# Altium schematic sheet LDO_5V.SchDoc
size A4
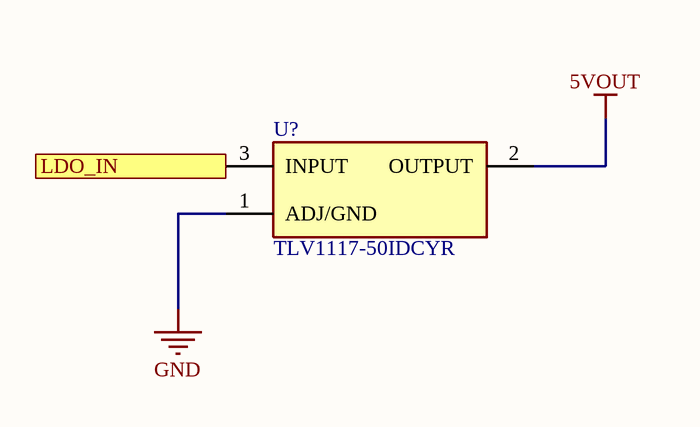
[diagram p0: LDO_5V.SchDoc]

## Parts
U?  TLV1117-50IDCYR  [TLV1117]

## Ports
LDO_IN

## Nets
5VOUT: U?.2(OUTPUT)
GND: U?.1(ADJ/GND)
LDO_IN: U?.3(INPUT) ; port LDO_IN

## Library data of the parts
U? = TLV1117-50IDCYR: Linear Voltage Regulator IC 5V 800MA SOT223-4; Manufacturer: Texas Instruments; Datasheet: http://www.ti.com/lit/ds/symlink/tlv1117.pdf?HQS=TI-null-null-digikeymode-df-pf-null-wwe&ts=1590668900314; Manufacturer Part Number: TLV1117-50IDCYR; Supplier Part Number: 296-21115-1-ND; Supplier: Digikey